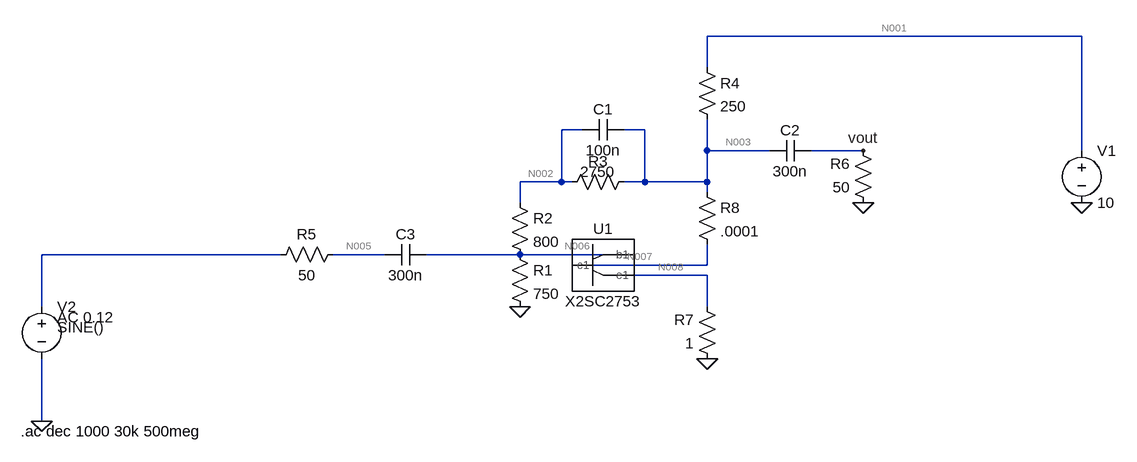
[diagram p0: schematic Broadband Owen.asc]
Broadband Owen.asc, the LTspice schematic file:
Version 4
SHEET 1 972 680
WIRE 928 -256 352 -256
WIRE 352 -208 352 -256
WIRE 160 -112 128 -112
WIRE 256 -112 224 -112
WIRE 352 -80 352 -128
WIRE 448 -80 352 -80
WIRE 592 -80 512 -80
WIRE 928 -80 928 -256
WIRE 128 -32 128 -112
WIRE 128 -32 64 -32
WIRE 144 -32 128 -32
WIRE 256 -32 256 -112
WIRE 256 -32 224 -32
WIRE 352 -32 352 -80
WIRE 352 -32 256 -32
WIRE 352 -16 352 -32
WIRE 64 0 64 -32
WIRE -304 80 -672 80
WIRE -144 80 -224 80
WIRE 64 80 -80 80
WIRE 240 80 64 80
WIRE 352 96 352 64
WIRE 352 96 144 96
WIRE 352 112 240 112
WIRE -672 160 -672 80
WIRE 352 160 352 112
WIRE -672 336 -672 240
FLAG -672 336 0
FLAG 592 0 0
FLAG 64 160 0
FLAG 352 240 0
FLAG 592 -80 vout
FLAG 928 0 0
SYMBOL voltage -672 144 R0
WINDOW 123 24 32 Left 2
WINDOW 39 24 64 Left 2
WINDOW 3 24 48 Left 2
SYMATTR Value2 AC 0.12
SYMATTR Value SINE()
SYMATTR InstName V2
SYMBOL AutoGenerated\\X2SC2753 192 96 R0
SYMATTR InstName U1
SYMBOL res 48 64 R0
SYMATTR InstName R1
SYMATTR Value 750
SYMBOL res 48 -16 R0
SYMATTR InstName R2
SYMATTR Value 800
SYMBOL res 240 -48 R90
WINDOW 0 0 56 VBottom 2
WINDOW 3 16 56 VBottom 2
SYMATTR InstName R3
SYMATTR Value 2750
SYMBOL cap 224 -128 R90
WINDOW 0 0 32 VBottom 2
WINDOW 3 32 32 VTop 2
SYMATTR InstName C1
SYMATTR Value 100n
SYMBOL cap 512 -96 R90
WINDOW 0 0 32 VBottom 2
WINDOW 3 32 32 VTop 2
SYMATTR InstName C2
SYMATTR Value 300n
SYMBOL cap -80 64 R90
WINDOW 0 0 32 VBottom 2
WINDOW 3 32 32 VTop 2
SYMATTR InstName C3
SYMATTR Value 300n
SYMBOL res -208 64 R90
WINDOW 0 0 56 VBottom 2
WINDOW 3 32 56 VTop 2
SYMATTR InstName R5
SYMATTR Value 50
SYMBOL res 608 16 R180
WINDOW 0 36 76 Left 2
WINDOW 3 36 40 Left 2
SYMATTR InstName R6
SYMATTR Value 50
SYMBOL res 368 256 R180
WINDOW 0 36 76 Left 2
WINDOW 3 36 40 Left 2
SYMATTR InstName R7
SYMATTR Value 1
SYMBOL voltage 928 -96 R0
WINDOW 123 0 0 Left 0
WINDOW 39 0 0 Left 0
SYMATTR InstName V1
SYMATTR Value 10
SYMBOL res 336 -224 R0
SYMATTR InstName R4
SYMATTR Value 250
SYMBOL res 336 -32 R0
SYMATTR InstName R8
SYMATTR Value .0001
TEXT -704 352 Left 2 !.ac dec 1000 30k 500meg

The netlist it stands for:
* Broadband Owen.asc
V2 N004 0 SINE() AC 0.12
XU1 N007 N006 N008 X2SC2753  ; pins c1 b1 e1
R1 N006 0 750
R2 N002 N006 800
R3 N003 N002 2750
C1 N003 N002 100n
C2 vout N003 300n
C3 N006 N005 300n
R5 N005 N004 50
R6 0 vout 50
R7 0 N008 1
V1 N001 0 10
R4 N001 N003 250
R8 N003 N007 .0001
.ac dec 1000 30k 500meg
.lib C:/Users/jonathansharir-smith/Desktop/251SPICE/Lab2/narrowband\2SC2753.lib
.backanno
.end

* Results of the author's LTspice run, read from the files saved beside the schematic
* Operating Point, zero values left out:
*   V(n006) = 858.1 mV
*   V(n007) = 5.678 V
*   V(n008) = 16.14 mV
*   V(n002) = 1.944 V
*   V(n003) = 5.678 V
*   V(n001) = 10 V
*   I(R1) = 1.144 mA
*   I(R2) = 1.358 mA
*   I(R3) = 1.358 mA
*   I(R7) = -16.14 mA
*   I(R4) = 17.29 mA
*   I(R8) = 15.93 mA
*   I(V1) = -17.29 mA
*   Ix(u1:C1) = 15.93 mA
*   Ix(u1:B1) = 213.6 µA
*   Ix(u1:E1) = -16.14 mA
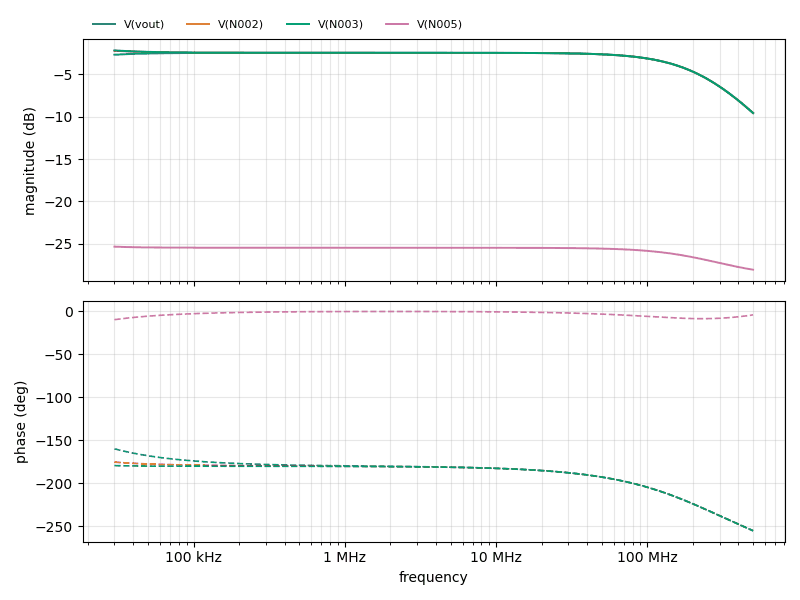
[diagram p1: AC Analysis of Broadband Owen.asc, plotted from the saved traces]
* AC Analysis, 1 run:
*   V(vout): -2.71 dB at 30 kHz, -9.58 dB at 500 MHz, peak -2.48 dB at 1.289 MHz, 3 dB below the peak at 244.9 MHz
*   V(N002): -2.24 dB at 30 kHz, -9.58 dB at 500 MHz, peak -2.24 dB at 30 kHz, 3 dB below the peak at 231.2 MHz
*   V(N003): -2.20 dB at 30 kHz, -9.58 dB at 500 MHz, peak -2.20 dB at 30 kHz, 3 dB below the peak at 228.9 MHz
*   V(N005): -25.33 dB at 30 kHz, -28.04 dB at 500 MHz, peak -25.33 dB at 30 kHz